# Altium schematic sheet TestPoints.SchDoc
size A
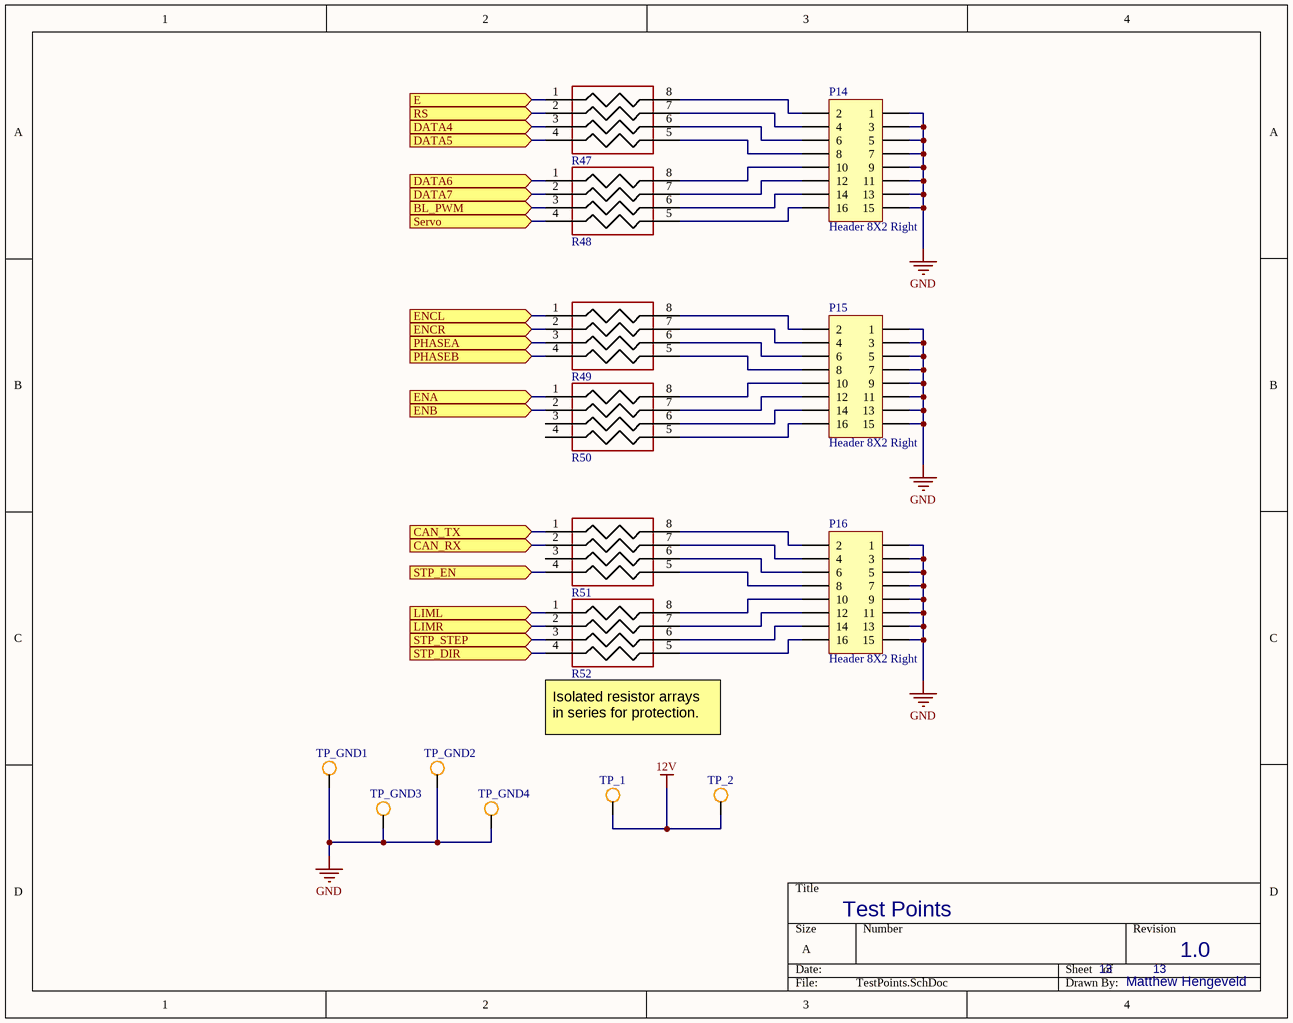
[diagram p0: TestPoints.SchDoc]

## Parts
P14  Header 8X2 Right  [HDR2X8 RIGHT]
P15  Header 8X2 Right  [HDR2X8 RIGHT]
P16  Header 8X2 Right  [HDR2X8 RIGHT]
R47  8RES_ISO_ARRAY  [4RES_ARRAY_1206]  (value not drawn)
R48  8RES_ISO_ARRAY  [4RES_ARRAY_1206]  (value not drawn)
R49  8RES_ISO_ARRAY  [4RES_ARRAY_1206]  (value not drawn)
R50  8RES_ISO_ARRAY  [4RES_ARRAY_1206]  (value not drawn)
R51  8RES_ISO_ARRAY  [4RES_ARRAY_1206]  (value not drawn)
R52  8RES_ISO_ARRAY  [4RES_ARRAY_1206]  (value not drawn)
TP_1  Test point  [SMD Test Hook]  (value not drawn)
TP_2  Test point  [SMD Test Hook]  (value not drawn)
TP_GND1  Test point  [SMD Test Hook]  (value not drawn)
TP_GND2  Test point  [SMD Test Hook]  (value not drawn)
TP_GND3  Test point  [SMD Test Hook]  (value not drawn)
TP_GND4  Test point  [SMD Test Hook]  (value not drawn)

## Ports
BL_PWM (in), CAN_RX (in), CAN_TX (in), DATA4 (in), DATA5 (in), DATA6 (in), DATA7 (in), E (in), ENA (in), ENB (in), ENCL (in), ENCR (in), LIML (in), LIMR (in), PHASEA (in), PHASEB (in), RS (in), Servo (in), STP_DIR (in), STP_EN (in), STP_STEP (in)

## Nets
12V: TP_1.1(point) TP_2.1(point)
GND: P14.1 P14.3 P14.5 P14.7 P14.9 P14.11 P14.13 P14.15 P15.1 P15.3 P15.5 P15.7 P15.9 P15.11 P15.13 P15.15 P16.1 P16.3 P16.5 P16.7 P16.9 P16.11 P16.13 P16.15 TP_GND1.1(point) TP_GND2.1(point) TP_GND3.1(point) TP_GND4.1(point)
BL_PWM: R48.3 ; port BL_PWM
CAN_RX: R51.2 ; port CAN_RX
CAN_TX: R51.1 ; port CAN_TX
DATA4: R47.3 ; port DATA4
DATA5: R47.4 ; port DATA5
DATA6: R48.1 ; port DATA6
DATA7: R48.2 ; port DATA7
E: R47.1 ; port E
ENA: R50.1 ; port ENA
ENB: R50.2 ; port ENB
ENCL: R49.1 ; port ENCL
ENCR: R49.2 ; port ENCR
LIML: R52.1 ; port LIML
LIMR: R52.2 ; port LIMR
PHASEA: R49.3 ; port PHASEA
PHASEB: R49.4 ; port PHASEB
RS: R47.2 ; port RS
Servo: R48.4 ; port Servo
STP_DIR: R52.4 ; port STP_DIR
STP_EN: R51.4 ; port STP_EN
STP_STEP: R52.3 ; port STP_STEP
NetP14_2: P14.2 R47.8
NetP14_4: P14.4 R47.7
NetP14_6: P14.6 R47.6
NetP14_8: P14.8 R47.5
NetP14_10: P14.10 R48.8
NetP14_12: P14.12 R48.7
NetP14_14: P14.14 R48.6
NetP14_16: P14.16 R48.5
NetP15_2: P15.2 R49.8
NetP15_4: P15.4 R49.7
NetP15_6: P15.6 R49.6
NetP15_8: P15.8 R49.5
NetP15_10: P15.10 R50.8
NetP15_12: P15.12 R50.7
NetP15_14: P15.14 R50.6
NetP15_16: P15.16 R50.5
NetP16_2: P16.2 R51.8
NetP16_4: P16.4 R51.7
NetP16_6: P16.6 R51.6
NetP16_8: P16.8 R51.5
NetP16_10: P16.10 R52.8
NetP16_12: P16.12 R52.7
NetP16_14: P16.14 R52.6
NetP16_16: P16.16 R52.5

Not connected (* = marked no-connect by the designer): R50 3(14) 4(14); R51 3(14)

## Notes on the sheet
- (near R52) Isolated resistor arrays in series for protection.
- Test Points
- 13
- 1.0
- Matthew Hengeveld

## Library data of the parts
P14-P16 = Header 8X2 Right: Header, 8-Pin, Dual row, Right Angle; LatestRevisionDate: 17-Jul-2002; LatestRevisionNote: Re-released for DXP Platform.; Publisher: Altium Limited
R47-R52 = 8RES_ISO_ARRAY: 4 Resistor Array